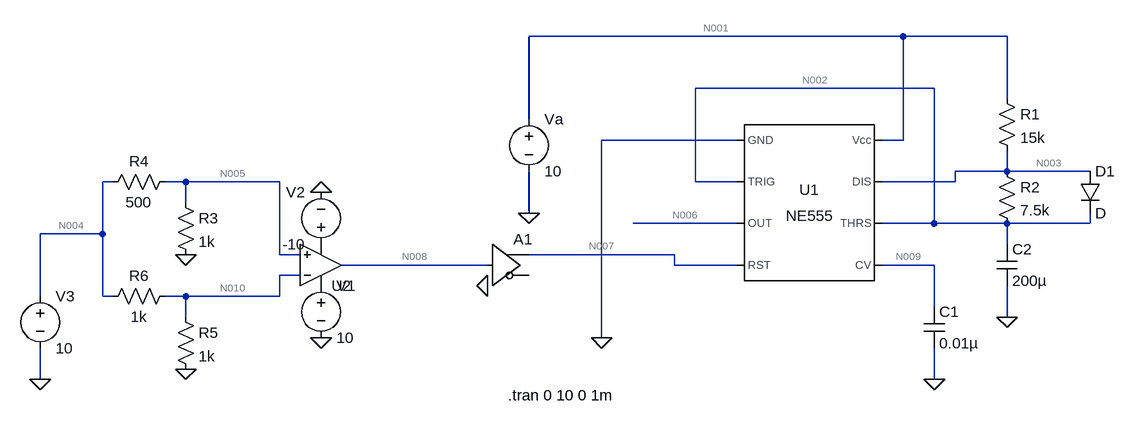
[diagram p0: schematic progetto_completo.asc]
progetto_completo.asc, the LTspice schematic file:
Version 4
SHEET 1 1140 680
WIRE 432 -208 -144 -208
WIRE 592 -208 432 -208
WIRE 480 -128 112 -128
WIRE 592 -112 592 -208
WIRE -144 -80 -144 -208
WIRE 176 -48 -32 -48
WIRE 432 -48 432 -208
WIRE 432 -48 400 -48
WIRE 592 0 592 -32
WIRE 592 0 512 0
WIRE 720 0 592 0
WIRE -784 16 -800 16
WIRE -672 16 -704 16
WIRE -528 16 -672 16
WIRE 112 16 112 -128
WIRE 176 16 112 16
WIRE 512 16 512 0
WIRE 512 16 400 16
WIRE -672 48 -672 16
WIRE -144 64 -144 0
WIRE 176 80 16 80
WIRE 480 80 480 -128
WIRE 480 80 400 80
WIRE 592 80 480 80
WIRE 720 80 720 64
WIRE 720 80 592 80
WIRE -800 96 -800 16
WIRE -800 96 -896 96
WIRE 592 112 592 80
WIRE -528 128 -528 16
WIRE -496 128 -528 128
WIRE 80 128 -144 128
WIRE -208 144 -432 144
WIRE 80 144 80 128
WIRE 176 144 80 144
WIRE 480 144 400 144
WIRE -496 160 -528 160
WIRE -896 192 -896 96
WIRE -800 192 -800 96
WIRE -784 192 -800 192
WIRE -672 192 -704 192
WIRE -528 192 -528 160
WIRE -528 192 -672 192
WIRE 480 208 480 144
WIRE -672 224 -672 192
WIRE 592 224 592 176
WIRE -32 256 -32 -48
WIRE -896 320 -896 272
WIRE 480 320 480 272
FLAG -32 256 0
FLAG -144 64 0
FLAG 480 320 0
FLAG 592 224 0
FLAG -464 32 0
FLAG -464 256 0
FLAG -672 128 0
FLAG -672 304 0
FLAG -896 320 0
FLAG -208 176 0
SYMBOL Misc\\NE555 288 48 R0
SYMATTR InstName U1
SYMBOL voltage -144 -96 R0
WINDOW 123 0 0 Left 0
WINDOW 39 0 0 Left 0
SYMATTR InstName Va
SYMATTR Value 10
SYMBOL cap 464 208 R0
SYMATTR InstName C1
SYMATTR Value 0.01µ
SYMBOL res 576 -16 R0
SYMATTR InstName R2
SYMATTR Value 7.5k
SYMBOL res 576 -128 R0
SYMATTR InstName R1
SYMATTR Value 15k
SYMBOL cap 576 112 R0
SYMATTR InstName C2
SYMATTR Value 200µ
SYMBOL diode 704 0 R0
SYMATTR InstName D1
SYMBOL OpAmps\\UniversalOpAmp2 -464 144 M180
SYMATTR InstName U2
SYMBOL voltage -464 160 R0
WINDOW 123 0 0 Left 0
WINDOW 39 0 0 Left 0
SYMATTR InstName V1
SYMATTR Value 10
SYMBOL voltage -464 128 R180
WINDOW 0 24 96 Left 2
WINDOW 3 24 16 Left 2
WINDOW 123 0 0 Left 0
WINDOW 39 0 0 Left 0
SYMATTR InstName V2
SYMATTR Value -10
SYMBOL res -688 32 R0
SYMATTR InstName R3
SYMATTR Value 1k
SYMBOL res -688 0 R90
WINDOW 0 0 56 VBottom 2
WINDOW 3 32 56 VTop 2
SYMATTR InstName R4
SYMATTR Value 500
SYMBOL res -688 208 R0
SYMATTR InstName R5
SYMATTR Value 1k
SYMBOL res -688 176 R90
WINDOW 0 0 56 VBottom 2
WINDOW 3 32 56 VTop 2
SYMATTR InstName R6
SYMATTR Value 1k
SYMBOL voltage -896 176 R0
WINDOW 123 0 0 Left 0
WINDOW 39 0 0 Left 0
SYMATTR InstName V3
SYMATTR Value 10
SYMBOL Digital\\buf -208 80 R0
SYMATTR InstName A1
TEXT -176 344 Left 2 !.tran 0 10 0 1m

The netlist it stands for:
* progetto_completo.asc
XU1 0 N002 N006 N007 N009 N002 N003 N001 NE555  ; pins GND TRIG OUT RST CV THRS DIS Vcc
Va N001 0 10
C1 N009 0 0.01µ
R2 N003 N002 7.5k
R1 N001 N003 15k
C2 N002 0 200µ
D1 N003 N002 D
XU2 N005 N010 P001 P002 N008 level2 Avol=1Meg GBW=10Meg Slew=10Meg Ilimit=25m Rail=0 Vos=0 En=0 Enk=0 In=0 Ink=0 Rin=500Meg  ; pins In+ In- V+ V- OUT
V1 P001 0 10
V2 P002 0 -10
R3 N005 0 1k
R4 N005 N004 500
R5 N010 0 1k
R6 N010 N004 1k
V3 N004 0 10
A1 N008 0 0 0 0 0 N007 0 BUF
.model D D
.lib standard.dio
.tran 0 10 0 1m
.lib NE555.sub
.lib UniversalOpAmp2.lib
.backanno
.end

* Results of the author's LTspice run, read from the files saved beside the schematic
* Operating Point, zero values left out:
*   V(n002) = 9.999 V
*   V(n009) = 6.667 V
*   V(n001) = 10 V
*   V(n003) = 10 V
*   V(n006) = 10 V
*   V(n007) = 1 V
*   V(n008) = 10 V
*   V(p001) = 10 V
*   V(p002) = -10 V
*   V(n010) = 5 V
*   V(n005) = 6.667 V
*   V(n004) = 10 V
*   I(R6) = -5 mA
*   I(R5) = 5 mA
*   I(R4) = -6.667 mA
*   I(R3) = 6.667 mA
*   I(R1) = 33.34 nA
*   I(R2) = 20 nA
*   I(V3) = -11.67 mA
*   I(V2) = 2.266 µA
*   I(V1) = -2.017 µA
*   I(Va) = -3.577 mA
*   I8(A1) = -400 µA
*   I7(A1) = 400 µA
*   Ix(u1:1) = -3.177 mA
*   Ix(u1:2) = 9.999 nA
*   Ix(u1:4) = -400 µA
*   Ix(u1:6) = 9.999 nA
*   Ix(u1:7) = 13.34 nA
*   Ix(u1:8) = 3.577 mA
*   Ix(u2:1) = 13.33 nA
*   Ix(u2:2) = 10 nA
*   Ix(u2:3) = 2.017 µA
*   Ix(u2:4) = -2.266 µA
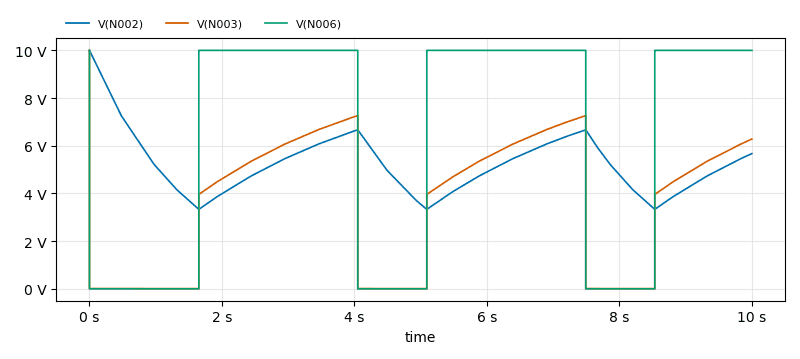
[diagram p1: Transient Analysis of progetto_completo.asc, plotted from the saved traces]
* Transient Analysis, 1 run:
*   V(N002): min 3.332 V, max 9.999 V, average 5.188 V, rms 5.352 V, last 5.671 V
*   V(N003): min 6.658 mV, max 10 V, average 3.56 V, rms 4.559 V, last 6.28 V
*   V(N006): min 60 µV, max 10 V, average 6.265 V, rms 7.915 V, last 10 V